# EAGLE design IV FET Array v2 (EAGLE 7.2.0)
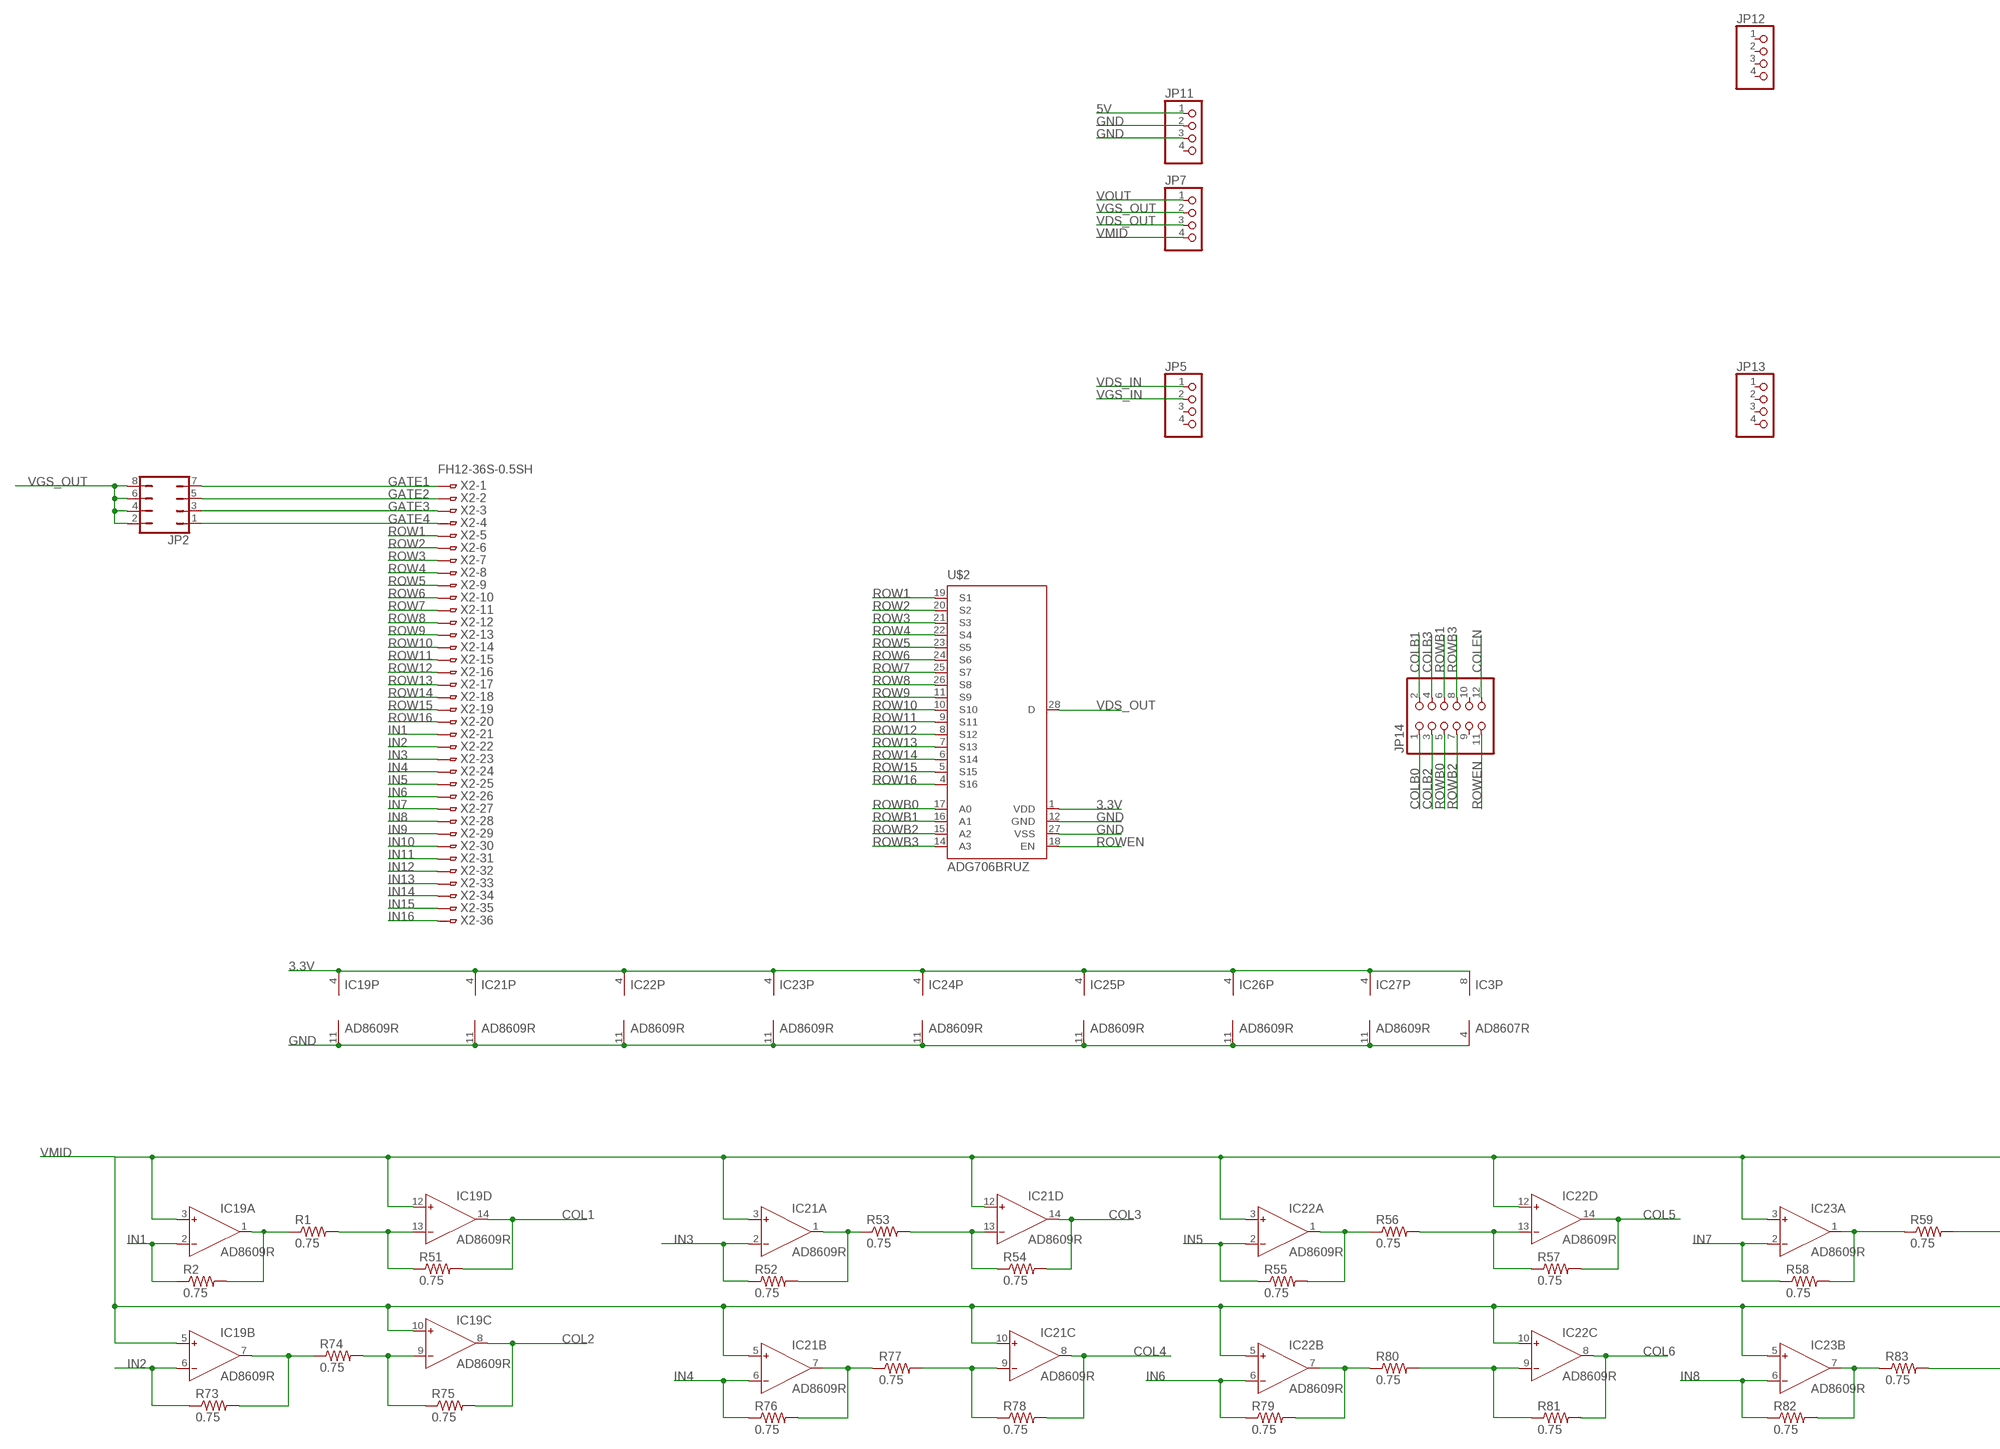
[diagram p0: schematic, sheet 1, part 1 of 2]
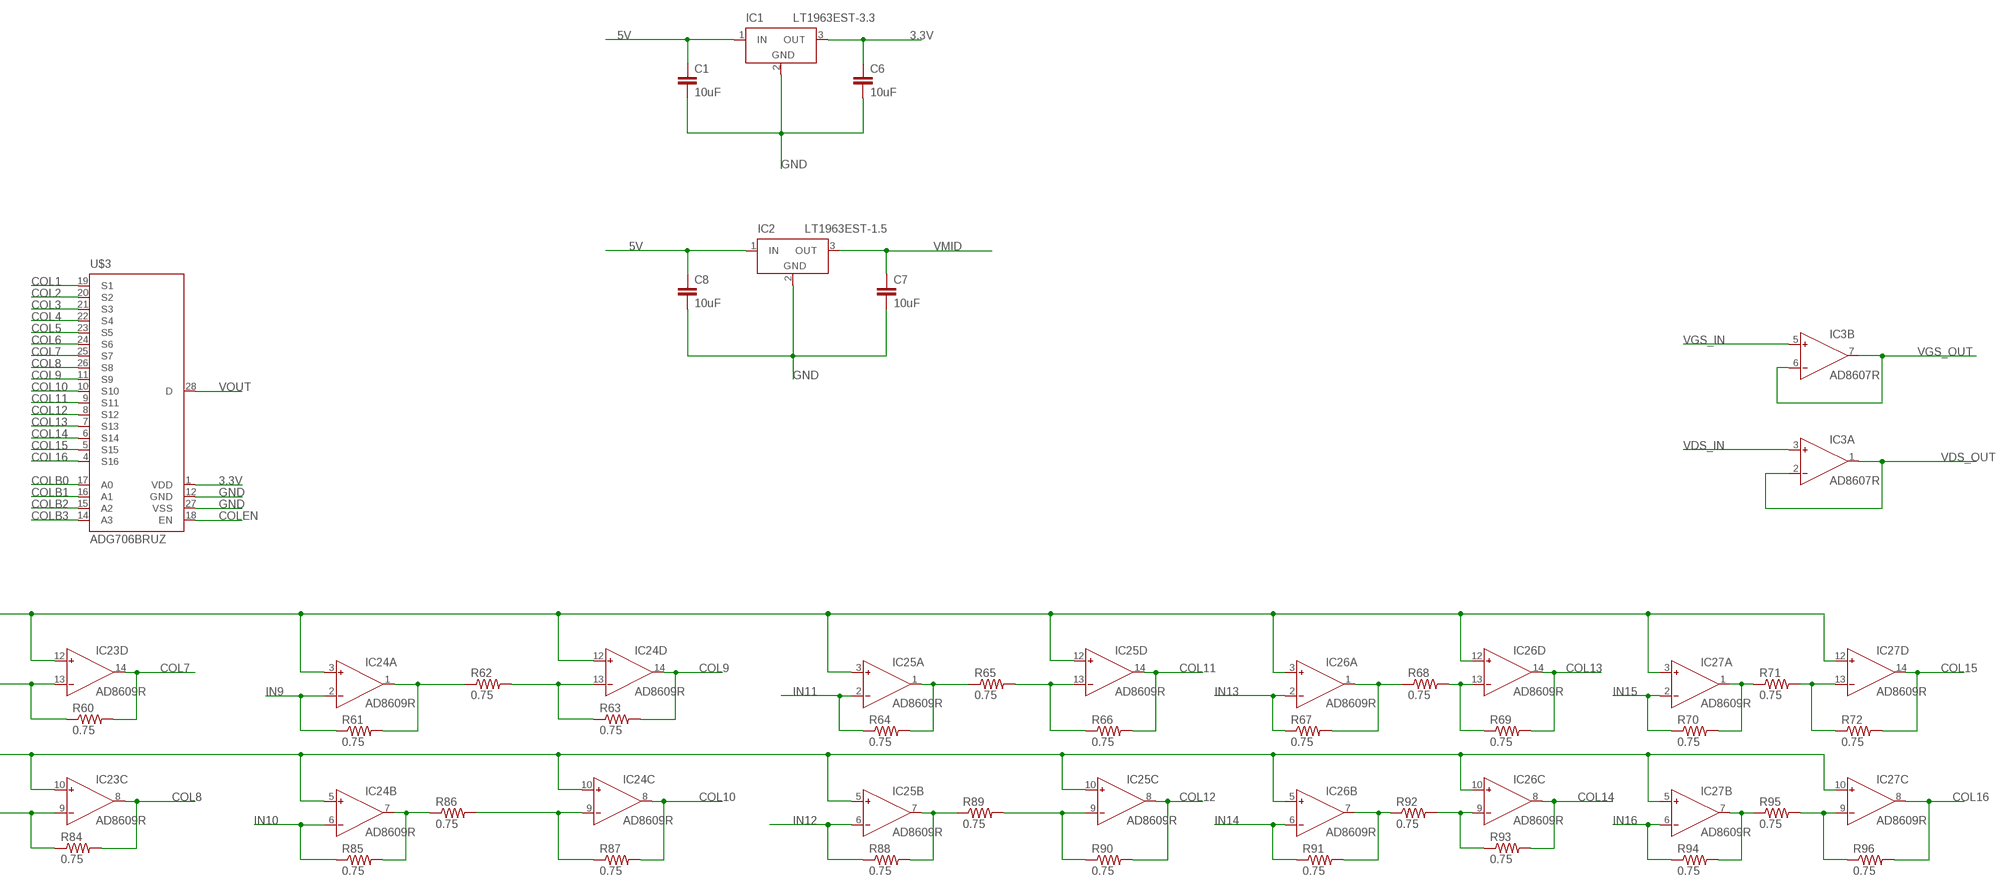
[diagram p1: schematic, sheet 1, part 2 of 2]

## Parts
C1  10uF  22UF-16V-20%-(1210)  [1210]
C6  10uF  22UF-16V-20%-(1210)  [1210]
C7  10uF  22UF-16V-20%-(1210)  [1210]
C8  10uF  22UF-16V-20%-(1210)  [1210]
IC1  LT1963EST-3.3  [SOT223]
IC2  LT1963EST-1.5  [SOT223]
IC3  AD8607R  [SO8]
IC19  AD8609R  [SO14]
IC21  AD8609R  [SO14]
IC22  AD8609R  [SO14]
IC23  AD8609R  [SO14]
IC24  AD8609R  [SO14]
IC25  AD8609R  [SO14]
IC26  AD8609R  [SO14]
IC27  AD8609R  [SO14]
JP2  JP4Q  [JP4Q]
JP5  PINHD-1X4  [1X04]
JP7  PINHD-1X4  [1X04]
JP11  PINHD-1X4  [1X04]
JP12  PINHD-1X4  [1X04]
JP13  PINHD-1X4  [1X04]
JP14  PINHD-2X6  [2X06]
R1  0.75  0.75OHM-1/4W-1%(0805)  [0805]
R2  0.75  0.75OHM-1/4W-1%(0805)  [0805]
R51  0.75  0.75OHM-1/4W-1%(0805)  [0805]
R52  0.75  0.75OHM-1/4W-1%(0805)  [0805]
R53  0.75  0.75OHM-1/4W-1%(0805)  [0805]
R54  0.75  0.75OHM-1/4W-1%(0805)  [0805]
R55  0.75  0.75OHM-1/4W-1%(0805)  [0805]
R56  0.75  0.75OHM-1/4W-1%(0805)  [0805]
R57  0.75  0.75OHM-1/4W-1%(0805)  [0805]
R58  0.75  0.75OHM-1/4W-1%(0805)  [0805]
R59  0.75  0.75OHM-1/4W-1%(0805)  [0805]
R60  0.75  0.75OHM-1/4W-1%(0805)  [0805]
R61  0.75  0.75OHM-1/4W-1%(0805)  [0805]
R62  0.75  0.75OHM-1/4W-1%(0805)  [0805]
R63  0.75  0.75OHM-1/4W-1%(0805)  [0805]
R64  0.75  0.75OHM-1/4W-1%(0805)  [0805]
R65  0.75  0.75OHM-1/4W-1%(0805)  [0805]
R66  0.75  0.75OHM-1/4W-1%(0805)  [0805]
R67  0.75  0.75OHM-1/4W-1%(0805)  [0805]
R68  0.75  0.75OHM-1/4W-1%(0805)  [0805]
R69  0.75  0.75OHM-1/4W-1%(0805)  [0805]
R70  0.75  0.75OHM-1/4W-1%(0805)  [0805]
R71  0.75  0.75OHM-1/4W-1%(0805)  [0805]
R72  0.75  0.75OHM-1/4W-1%(0805)  [0805]
R73  0.75  0.75OHM-1/4W-1%(0805)  [0805]
R74  0.75  0.75OHM-1/4W-1%(0805)  [0805]
R75  0.75  0.75OHM-1/4W-1%(0805)  [0805]
R76  0.75  0.75OHM-1/4W-1%(0805)  [0805]
R77  0.75  0.75OHM-1/4W-1%(0805)  [0805]
R78  0.75  0.75OHM-1/4W-1%(0805)  [0805]
R79  0.75  0.75OHM-1/4W-1%(0805)  [0805]
R80  0.75  0.75OHM-1/4W-1%(0805)  [0805]
R81  0.75  0.75OHM-1/4W-1%(0805)  [0805]
R82  0.75  0.75OHM-1/4W-1%(0805)  [0805]
R83  0.75  0.75OHM-1/4W-1%(0805)  [0805]
R84  0.75  0.75OHM-1/4W-1%(0805)  [0805]
R85  0.75  0.75OHM-1/4W-1%(0805)  [0805]
R86  0.75  0.75OHM-1/4W-1%(0805)  [0805]
R87  0.75  0.75OHM-1/4W-1%(0805)  [0805]
R88  0.75  0.75OHM-1/4W-1%(0805)  [0805]
R89  0.75  0.75OHM-1/4W-1%(0805)  [0805]
R90  0.75  0.75OHM-1/4W-1%(0805)  [0805]
R91  0.75  0.75OHM-1/4W-1%(0805)  [0805]
R92  0.75  0.75OHM-1/4W-1%(0805)  [0805]
R93  0.75  0.75OHM-1/4W-1%(0805)  [0805]
R94  0.75  0.75OHM-1/4W-1%(0805)  [0805]
R95  0.75  0.75OHM-1/4W-1%(0805)  [0805]
R96  0.75  0.75OHM-1/4W-1%(0805)  [0805]
U$2  ADG706BRUZ  [TSSOP28]
U$3  ADG706BRUZ  [TSSOP28]
X2  FH12-36S-0.5SH  [FH12-36S-0.5SH]

## Nets
3.3V: C6.1 IC1.3(OUT) IC3.8(P:V+) IC19.4(P:V+) IC21.4(P:V+) IC22.4(P:V+) IC23.4(P:V+) IC24.4(P:V+) IC25.4(P:V+) IC26.4(P:V+) IC27.4(P:V+) U$2.1(VDD) U$3.1(VDD)
5V: C1.1 C8.1 IC1.1(IN) IC2.1(IN) JP11.1
COL1: IC19.14(D:OUT) R51.2 U$3.19(S1)
COL2: IC19.8(C:OUT) R75.2 U$3.20(S2)
COL3: IC21.14(D:OUT) R54.2 U$3.21(S3)
COL4: IC21.8(C:OUT) R78.2 U$3.22(S4)
COL5: IC22.14(D:OUT) R57.2 U$3.23(S5)
COL6: IC22.8(C:OUT) R81.2 U$3.24(S6)
COL7: IC23.14(D:OUT) R60.2 U$3.25(S7)
COL8: IC23.8(C:OUT) R84.2 U$3.26(S8)
COL9: IC24.14(D:OUT) R63.2 U$3.11(S9)
COL10: IC24.8(C:OUT) R87.2 U$3.10(S10)
COL11: IC25.14(D:OUT) R66.2 U$3.9(S11)
COL12: IC25.8(C:OUT) R90.2 U$3.8(S12)
COL13: IC26.14(D:OUT) R69.2 U$3.7(S13)
COL14: IC26.8(C:OUT) R93.2 U$3.6(S14)
COL15: IC27.14(D:OUT) R72.2 U$3.5(S15)
COL16: IC27.8(C:OUT) R96.2 U$3.4(S16)
COLB0: JP14.1 U$3.17(A0)
COLB1: JP14.2 U$3.16(A1)
COLB2: JP14.3 U$3.15(A2)
COLB3: JP14.4 U$3.14(A3)
COLEN: JP14.12 U$3.18(EN)
GATE1: JP2.7 X2.1
GATE2: JP2.5 X2.2
GATE3: JP2.3 X2.3
GATE4: JP2.1 X2.4
GND: C1.2 C6.2 C7.2 C8.2 IC1.2(GND) IC2.2(GND) IC3.4(P:V-) IC19.11(P:V-) IC21.11(P:V-) IC22.11(P:V-) IC23.11(P:V-) IC24.11(P:V-) IC25.11(P:V-) IC26.11(P:V-) IC27.11(P:V-) JP11.2 JP11.3 U$2.12(GND) U$2.27(VSS) U$3.12(GND) U$3.27(VSS)
IN1: IC19.2(A:IN-) R2.1 X2.21
IN2: IC19.6(B:IN-) R73.1 X2.22
IN3: IC21.2(A:IN-) R52.1 X2.23
IN4: IC21.6(B:IN-) R76.1 X2.24
IN5: IC22.2(A:IN-) R55.1 X2.25
IN6: IC22.6(B:IN-) R79.1 X2.26
IN7: IC23.2(A:IN-) R58.1 X2.27
IN8: IC23.6(B:IN-) R82.1 X2.28
IN9: IC24.2(A:IN-) R61.1 X2.29
IN10: IC24.6(B:IN-) R85.1 X2.30
IN11: IC25.2(A:IN-) R64.1 X2.31
IN12: IC25.6(B:IN-) R88.1 X2.32
IN13: IC26.2(A:IN-) R67.1 X2.33
IN14: IC26.6(B:IN-) R91.1 X2.34
IN15: IC27.2(A:IN-) R70.1 X2.35
IN16: IC27.6(B:IN-) R94.1 X2.36
N$2: IC25.1(A:OUT) R64.2 R65.1
N$3: IC25.13(D:IN-) R65.2 R66.1
N$4: IC24.1(A:OUT) R61.2 R62.1
N$5: IC24.13(D:IN-) R62.2 R63.1
N$7: IC25.7(B:OUT) R88.2 R89.1
N$9: IC25.9(C:IN-) R89.2 R90.1
N$12: IC24.9(C:IN-) R86.2 R87.1
N$13: IC24.7(B:OUT) R85.2 R86.1
N$14: IC19.1(A:OUT) R1.1 R2.2
N$16: IC19.7(B:OUT) R73.2 R74.1
N$17: IC19.9(C:IN-) R74.2 R75.1
N$18: IC19.13(D:IN-) R1.2 R51.1
N$21: IC23.13(D:IN-) R59.2 R60.1
N$22: IC23.1(A:OUT) R58.2 R59.1
N$24: IC21.1(A:OUT) R52.2 R53.1
N$25: IC21.13(D:IN-) R53.2 R54.1
N$27: IC22.1(A:OUT) R55.2 R56.1
N$29: IC22.13(D:IN-) R56.2 R57.1
N$31: IC23.9(C:IN-) R83.2 R84.1
N$32: IC23.7(B:OUT) R82.2 R83.1
N$35: IC22.9(C:IN-) R80.2 R81.1
N$36: IC22.7(B:OUT) R79.2 R80.1
N$39: IC21.9(C:IN-) R77.2 R78.1
N$40: IC21.7(B:OUT) R76.2 R77.1
N$68: IC26.1(A:OUT) R67.2 R68.1
N$69: IC26.13(D:IN-) R68.2 R69.1
N$72: IC26.9(C:IN-) R92.2 R93.1
N$73: IC26.7(B:OUT) R91.2 R92.1
N$76: IC27.7(B:OUT) R94.2 R95.1
N$77: IC27.9(C:IN-) R95.2 R96.1
N$78: IC27.13(D:IN-) R71.2 R72.1
N$79: IC27.1(A:OUT) R70.2 R71.1
ROW1: U$2.19(S1) X2.5
ROW2: U$2.20(S2) X2.6
ROW3: U$2.21(S3) X2.7
ROW4: U$2.22(S4) X2.8
ROW5: U$2.23(S5) X2.9
ROW6: U$2.24(S6) X2.10
ROW7: U$2.25(S7) X2.11
ROW8: U$2.26(S8) X2.12
ROW9: U$2.11(S9) X2.13
ROW10: U$2.10(S10) X2.14
ROW11: U$2.9(S11) X2.15
ROW12: U$2.8(S12) X2.16
ROW13: U$2.7(S13) X2.17
ROW14: U$2.6(S14) X2.18
ROW15: U$2.5(S15) X2.19
ROW16: U$2.4(S16) X2.20
ROWB0: JP14.5 U$2.17(A0)
ROWB1: JP14.6 U$2.16(A1)
ROWB2: JP14.7 U$2.15(A2)
ROWB3: JP14.8 U$2.14(A3)
ROWEN: JP14.11 U$2.18(EN)
VDS_IN: IC3.3(A:IN+) JP5.1
VDS_OUT: IC3.1(A:OUT) IC3.2(A:IN-) JP7.3 U$2.28(D)
VGS_IN: IC3.5(B:IN+) JP5.2
VGS_OUT: IC3.6(B:IN-) IC3.7(B:OUT) JP2.2 JP2.4 JP2.6 JP2.8 JP7.2
VMID: C7.1 IC2.3(OUT) IC19.3(A:IN+) IC19.5(B:IN+) IC19.10(C:IN+) IC19.12(D:IN+) IC21.3(A:IN+) IC21.5(B:IN+) IC21.10(C:IN+) IC21.12(D:IN+) IC22.3(A:IN+) IC22.5(B:IN+) IC22.10(C:IN+) IC22.12(D:IN+) IC23.3(A:IN+) IC23.5(B:IN+) IC23.10(C:IN+) IC23.12(D:IN+) IC24.3(A:IN+) IC24.5(B:IN+) IC24.10(C:IN+) IC24.12(D:IN+) IC25.3(A:IN+) IC25.5(B:IN+) IC25.10(C:IN+) IC25.12(D:IN+) IC26.3(A:IN+) IC26.5(B:IN+) IC26.10(C:IN+) IC26.12(D:IN+) IC27.3(A:IN+) IC27.5(B:IN+) IC27.10(C:IN+) IC27.12(D:IN+) JP7.4
VOUT: JP7.1 U$3.28(D)
Unconnected: JP5.3 JP5.4 JP11.4 JP12.1 JP12.2 JP12.3 JP12.4 JP13.1 JP13.2 JP13.3 JP13.4 JP14.9 JP14.10

## Power pins joined to a net without a drawn wire
GND: IC1.4(GND) IC2.4(GND)

## Library data of the parts
C1 C6-C8 = SparkFun-Capacitors:22UF-16V-20%-(1210): CAP-10381; PROD_ID: CAP-10381; VALUE: 22uF
IC1 = linear-technology:LT1963EST: 1.5A, Low Noise, Fast Transient Response LDO Regulator Source: http://www.linear.com/pc/downloadDocument.do?navId=H0,C3,P2222,D3148; MPN: LT1963EST-3.3; OC_FARNELL: 1501032; OC_NEWARK: 57M7546
IC2 = linear-technology:LT1963EST: 1.5A, Low Noise, Fast Transient Response LDO Regulator Source: http://www.linear.com/pc/downloadDocument.do?navId=H0,C3,P2222,D3148; MPN: LT1963EST-1.5; OC_FARNELL: 1663528; OC_NEWARK: 57M7534
IC3 = analog-devices:AD8607: Precision Micropower, Low Noise CMOS, Rail-to-Rail Input/Output Operational Amplifiers Source: http://www.analog.com/static/imported-files/data_sheets/AD8603_8607_8609.pdf; MPN: AD8607ARMZ-R2; OC_FARNELL: 1651293; OC_NEWARK: 19M8927
IC19 IC21-IC27 = analog-devices:AD8609: Precision Micropower, Low Noise CMOS, Rail-to-Rail Input/Output Operational Amplifiers Source: http://www.analog.com/static/imported-files/data_sheets/AD8603_8607_8609.pdf; MPN: AD8609ARZ; OC_FARNELL: 1581951; OC_NEWARK: 19M0976
JP2 = jumper:JP4Q: JUMPER
JP5 JP7 JP11-JP13 = pinhead:PINHD-1X4: PIN HEADER
JP14 = pinhead:PINHD-2X6: PIN HEADER
R1 R2 R51-R96 = SparkFun-Resistors:0.75OHM-1/4W-1%(0805): RES-08474; PROD_ID: RES-08474
U$2 U$3 = mux:ADG706: CMOS, +1.8 V to +5.5 V/±2.5 V, 2.5 Ω Low-Voltage, 16-Channel Multiplexer Source: ADG706.pdf; RS: 523-6478
X2 = con-hirose:FH12-36S-0.5S: 0.5mm Pitch Connectors For FPC/FFC Source: Data sheet <http://www.hirose.co.jp/cataloge_hp/e58605370.pdf>; OC_FARNELL: unknown; OC_NEWARK: unknown

## Board
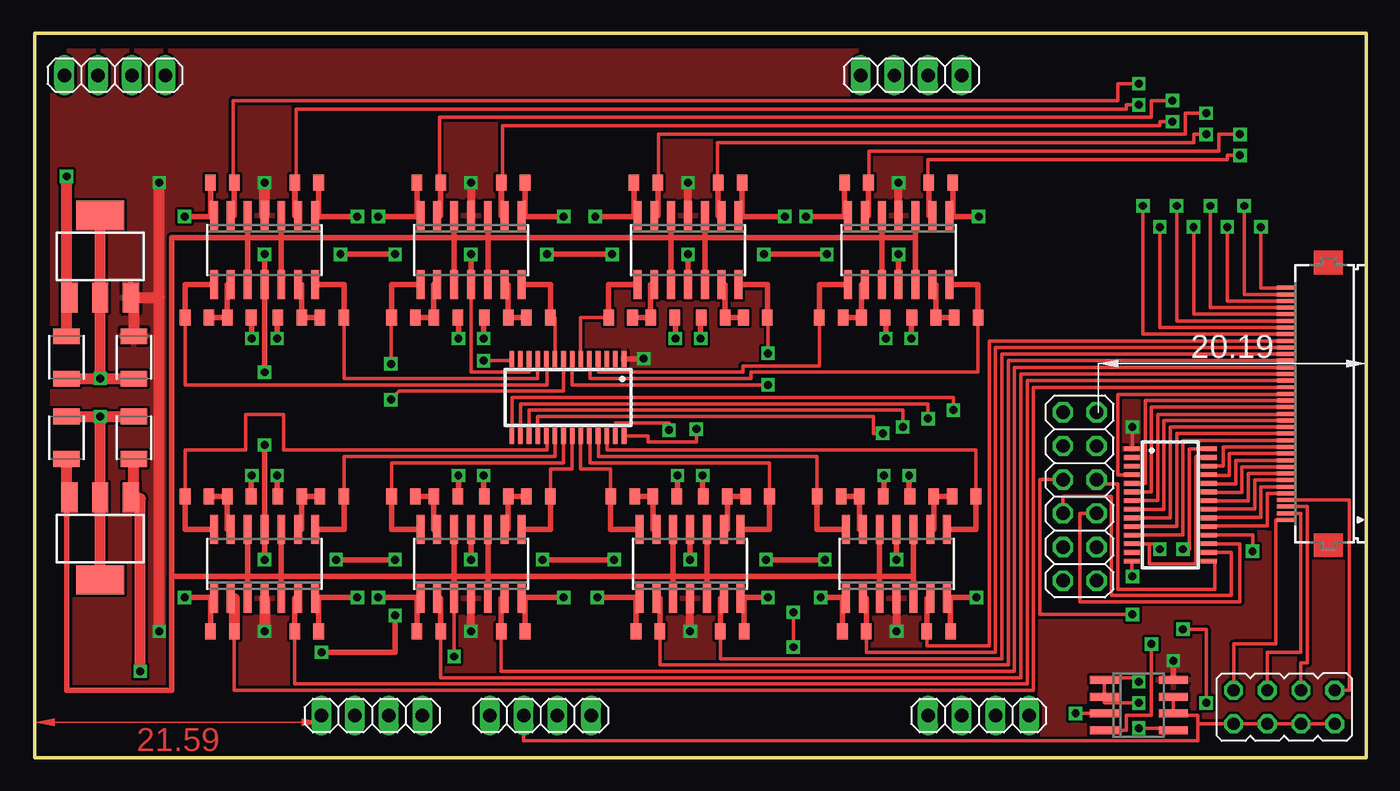
[diagram p2: board, top side]
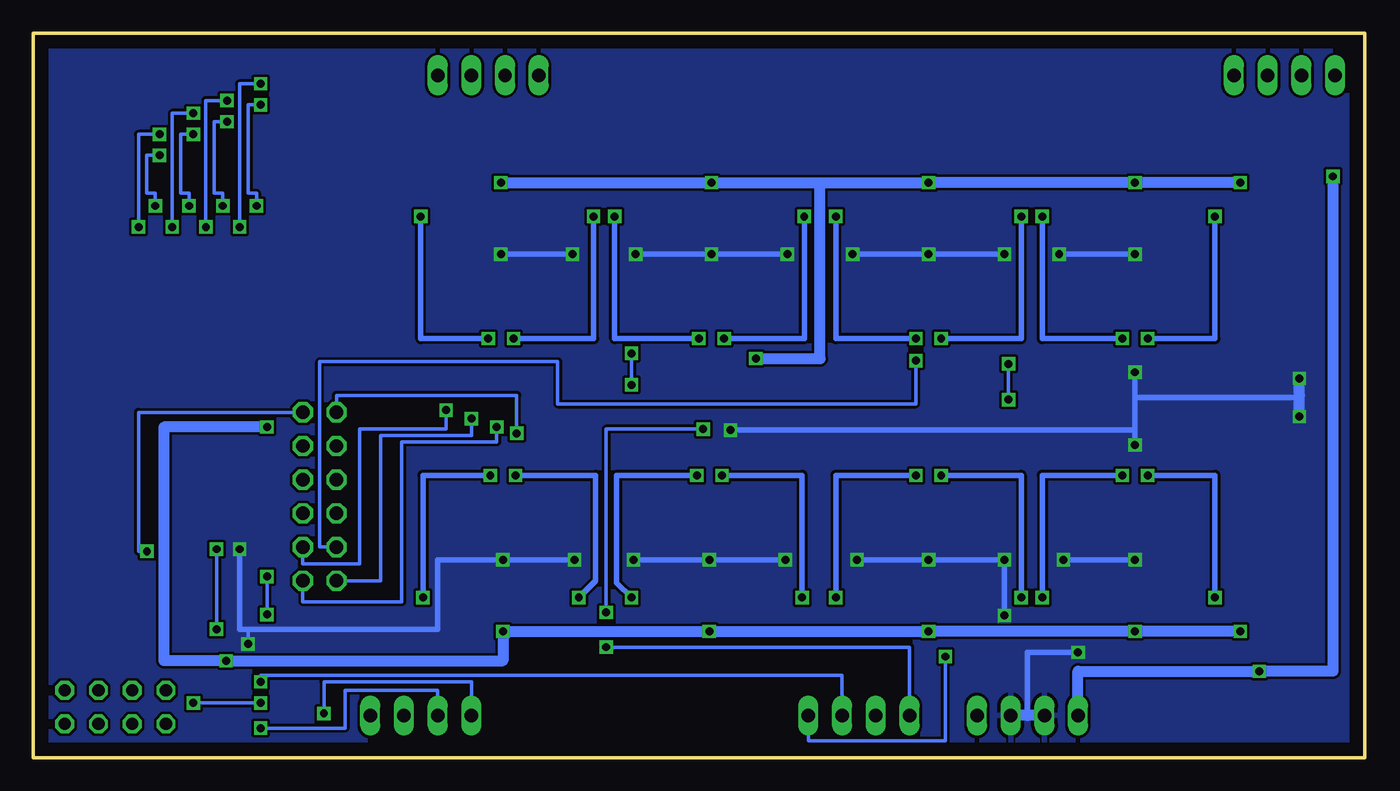
[diagram p3: board, bottom side, seen from below]

Size 100.33 x 54.61 mm. Coordinates in mm from the lower left corner, seen from the top.
Outline: 100.33,0 0,0 0,54.61 100.33,54.61 100.33,0
Copper layers (1*16): Top 0.035mm / dielectric 1.5mm / Bottom 0.035mm
Design rules "default": minimum track width 10mil, minimum drill 24mil, track to track 8mil, track to pad 8mil, pad to pad 8mil, via to via 8mil, smd to smd 8mil, copper to edge 40mil, drill to drill 8mil, minimum pad ring 10mil, minimum via ring 8mil, stop-mask expansion 4mil, vias tented up to drill 0mil, thermal gap 10mil

### Footprints (pad centres in the part's own frame; a part is rotated, then mirrored left to right if it is on the bottom)
1210 = smd 1.2 x 2: 1 -1.6,0; 2 1.6,0
SOT223 = smd 1.219 x 2.235: 1 -2.311,-3.099; 2 0,-3.099; 3 2.311,-3.099 | smd 3.6 x 2.2: 4 0,3.099
SO8 = smd 0.6 x 2.2: 1 -1.905,-2.6; 2 -0.635,-2.6; 3 0.635,-2.6; 4 1.905,-2.6; 5 1.905,2.6; 6 0.635,2.6; 7 -0.635,2.6; 8 -1.905,2.6
SO14 = smd 0.6 x 2.2: 1 -3.81,-2.6; 2 -2.54,-2.6; 3 -1.27,-2.6; 4 0,-2.6; 5 1.27,-2.6; 6 2.54,-2.6; 7 3.81,-2.6; 8 3.81,2.6; 9 2.54,2.6; 10 1.27,2.6; 11 0,2.6; 12 -1.27,2.6; 13 -2.54,2.6; 14 -3.81,2.6
JP4Q = drill 0.914 octagon: 1 -3.81,-1.27; 2 -3.81,1.27; 3 -1.27,-1.27; 4 -1.27,1.27; 5 1.27,-1.27; 6 1.27,1.27; 7 3.81,-1.27; 8 3.81,1.27
1X04 = drill 1.016 long: 1 -3.81,0; 2 -1.27,0; 3 1.27,0; 4 3.81,0
2X06 = drill 1.016 octagon: 1 -6.35,-1.27; 2 -6.35,1.27; 3 -3.81,-1.27; 4 -3.81,1.27; 5 -1.27,-1.27; 6 -1.27,1.27; 7 1.27,-1.27; 8 1.27,1.27; 9 3.81,-1.27; 10 3.81,1.27; 11 6.35,-1.27; 12 6.35,1.27
0805 = smd 0.8 x 1.2: 1 -0.9,0; 2 0.9,0
TSSOP28 = smd 0.35 x 1.2: 1 -4.225,-2.9; 2 -3.575,-2.9; 3 -2.925,-2.9; 4 -2.275,-2.9; 5 -1.625,-2.9; 6 -0.975,-2.9; 7 -0.325,-2.9; 8 0.325,-2.9; 9 0.975,-2.9; 10 1.625,-2.9; 11 2.275,-2.9; 12 2.925,-2.9; 13 3.575,-2.9; 14 4.225,-2.9; 15 4.225,2.9; 16 3.575,2.9; 17 2.925,2.9; 18 2.275,2.9; 19 1.625,2.9; 20 0.975,2.9; 21 0.325,2.9; 22 -0.325,2.9; 23 -0.975,2.9; 24 -1.625,2.9; 25 -2.275,2.9; 26 -2.925,2.9; 27 -3.575,2.9; 28 -4.225,2.9
FH12-36S-0.5SH = smd 0.3 x 1.3: 1 -8.75,3.25; 2 -8.25,3.25; 3 -7.75,3.25; 4 -7.25,3.25; 5 -6.75,3.25; 6 -6.25,3.25; 7 -5.75,3.25; 8 -5.25,3.25; 9 -4.75,3.25; 10 -4.25,3.25; 11 -3.75,3.25; 12 -3.25,3.25; 13 -2.75,3.25; 14 -2.25,3.25; 15 -1.75,3.25; 16 -1.25,3.25; 17 -0.75,3.25; 18 -0.25,3.25; 19 0.25,3.25; 20 0.75,3.25; 21 1.25,3.25; 22 1.75,3.25; 23 2.25,3.25; 24 2.75,3.25; 25 3.25,3.25; 26 3.75,3.25; 27 4.25,3.25; 28 4.75,3.25; 29 5.25,3.25; 30 5.75,3.25; 31 6.25,3.25; 32 6.75,3.25; 33 7.25,3.25; 34 7.75,3.25; 35 8.25,3.25; 36 8.75,3.25

### Placement (x,y rotation side)
C1  2.38,30.16 270 top
C6  7.46,30.16 270 top
C7  2.38,24.13 90 top
C8  7.46,24.13 90 top
IC1  4.92,37.78 0 top
IC2  4.92,16.51 180 top
IC3  83.19,3.97 270 top
IC19  17.3,14.61 0 top
IC21  32.86,14.61 0 top
IC22  49.37,14.61 0 top
IC23  64.93,14.61 0 top
IC24  17.3,38.26 180 top
IC25  32.86,38.26 180 top
IC26  49.21,38.26 180 top
IC27  65.09,38.26 180 top
JP2  94.14,3.81 180 top
JP5  71.12,3.17 0 top
JP7  38.1,3.17 0 top
JP11  25.4,3.17 0 top
JP12  6.03,51.44 0 top
JP13  66.04,51.44 0 top
JP14  78.74,19.68 90 top
R1  15.4,19.68 180 top
R2  14.13,9.53 180 top
R51  12.22,19.68 180 top
R52  29.69,9.53 180 top
R53  30.96,19.68 180 top
R54  27.78,19.68 180 top
R55  46.2,9.53 180 top
R56  47.47,19.68 180 top
R57  44.29,19.68 180 top
R58  61.75,9.53 180 top
R59  63.02,19.68 180 top
R60  59.85,19.68 180 top
R61  20.48,43.34 0 top
R62  19.21,33.18 0 top
R63  22.38,33.18 0 top
R64  36.04,43.34 0 top
R65  34.77,33.18 0 top
R66  37.94,33.18 0 top
R67  52.39,43.34 0 top
R68  51.12,33.18 0 top
R69  54.29,33.18 0 top
R70  68.26,43.34 0 top
R71  66.99,33.18 0 top
R72  70.17,33.18 0 top
R73  20.48,9.53 0 top
R74  19.21,19.68 0 top
R75  22.38,19.68 0 top
R76  36.04,9.53 0 top
R77  34.77,19.68 0 top
R78  37.94,19.68 0 top
R79  52.55,9.53 0 top
R80  51.28,19.68 0 top
R81  54.45,19.68 0 top
R82  68.1,9.53 0 top
R83  66.83,19.68 0 top
R84  70.01,19.68 0 top
R85  14.13,43.34 180 top
R86  15.4,33.18 180 top
R87  12.22,33.18 180 top
R88  29.69,43.34 180 top
R89  30.96,33.18 180 top
R90  27.78,33.18 180 top
R91  46.04,43.34 180 top
R92  47.31,33.18 180 top
R93  44.13,33.18 180 top
R94  61.91,43.34 180 top
R95  63.18,33.18 180 top
R96  60.01,33.18 180 top
U$2  85.57,19.05 270 top
U$3  40.16,27.15 180 top
X2  97.47,26.67 90 top

### Tracks (layer width: path | path; a pad name or v marks a point on that pad's centre or on a via)
3.3V  (via drill 0.6)
  Top 0.254: U$2.1 82.71,23.27 v82.71,24.92
  Top 0.406: v85.78,7.3 IC3.8 | U$3.1 45.88,30.05 v45.88,30.08
  Top 0.61: IC23.4 v64.93,9.53 | v49.37,9.53 IC22.4 | v32.86,9.53 IC21.4 | IC26.4 v49.21,43.34 | v32.86,43.34 IC25.4 | IC27.4 v65.09,43.34
  Top 0.813: IC1.3 7.46,34.68 | 7.46,34.68 C6.1 | IC19.4 v17.3,9.53 | IC24.4 v17.3,43.34 | 7.46,34.68 9.37,34.68 | 9.37,34.68 v9.37,43.34 | v9.37,9.53 9.37,34.68
  Bottom 0.813: 41.04,43.34 v49.21,43.34 v65.09,43.34 | 41.04,43.34 v32.86,43.34 v17.3,43.34 v9.37,43.34 | v82.71,24.92 90.49,24.92 90.49,7.3 v85.78,7.3 64.93,7.3 v64.93,9.53 v49.37,9.53 v32.86,9.53 v17.3,9.53 v9.37,9.53 | 41.04,43.34 41.04,30.08 v45.88,30.08
  pour Top: 0,0 100.33,0 100.33,54.61 0,54.61
5V  (via drill 0.6)
  Top 0.813: C8.1 7.46,19.61 IC2.1 7.23,19.53 7.94,19.53 v7.94,6.51 | IC1.1 2.38,34.68 | C1.1 2.38,34.68 | 2.38,34.68 v2.38,43.81
  Bottom 0.813: JP11.1 21.59,6.51 v7.94,6.51 2.38,6.51 v2.38,43.81
COL1
  Top 0.254: U$3.19 38.58,24.09 38.58,23.18 18.73,23.18 18.73,25.88 15.88,25.88 15.88,23.18 11.32,23.18 R51.2
  Top 0.406: IC19.14 11.32,17.2 R51.2
COL2
  Top 0.254: U$3.20 39.21,24.09 39.21,22.7 23.28,22.7 R75.2
  Top 0.406: IC19.8 23.28,17.2 R75.2
COL3
  Top 0.254: U$3.21 39.85,24.09 39.85,22.23 26.88,22.23 R54.2
  Top 0.406: IC21.14 26.88,17.2 R54.2
COL4
  Top 0.254: U$3.22 40.48,24.09 40.48,21.75 38.84,21.75 R78.2
  Top 0.406: IC21.8 38.84,17.2 R78.2
COL5
  Top 0.254: U$3.23 41.12,24.09 41.12,21.75 43.39,21.75 R57.2
  Top 0.406: IC22.14 43.39,17.2 R57.2
COL6
  Top 0.254: U$3.24 41.83,24.09 41.83,22.23 55.35,22.23 R81.2
  Top 0.406: IC22.8 55.35,17.2 R81.2
COL7
  Top 0.254: U$3.25 42.47,24.09 42.47,22.7 58.95,22.7 R60.2
  Top 0.406: IC23.14 58.95,17.2 R60.2
COL8
  Top 0.254: U$3.26 43.1,24.09 43.1,23.18 70.91,23.18 R84.2
  Top 0.406: IC23.8 70.91,17.2 R84.2
COL9
  Top 0.254: U$3.11 37.86,29.89 37.86,28.57 23.28,28.57 R63.2
  Top 0.406: IC24.14 23.28,35.66 R63.2
COL10
  Top 0.254: U$3.10 38.58,29.89 38.58,28.1 11.32,28.1 R87.2
  Top 0.406: IC24.8 11.32,35.66 R87.2
COL11
  Top 0.254: R66.2 38.89,33.18 | 38.89,33.18 38.89,35.72 | 38.89,33.18 39.19,33.18 U$3.9
  Top 0.406: IC25.14 38.84,35.66 R66.2
COL12  (via drill 0.6)
  Top 0.254: U$3.8 39.85,29.89 39.85,27.62 27.46,27.62 v26.83,26.99 | R90.2 26.83,33.18 v26.83,29.69
  Top 0.406: IC25.8 26.88,35.66 R90.2
  Bottom 0.254: v26.83,26.99 v26.83,29.69
COL13  (via drill 0.6)
  Top 0.254: R69.2 55.24,33.18 v55.24,30.48 | U$3.7 40.48,29.89 40.48,28.1 v55.24,28.1
  Top 0.406: IC26.14 55.19,35.66 R69.2
  Bottom 0.254: v55.24,30.48 v55.24,28.1
COL14
  Top 0.254: U$3.6 41.12,29.89 41.12,33.18 R93.2
  Top 0.406: IC26.8 43.23,35.66 R93.2
COL15
  Top 0.254: U$3.5 41.83,29.89 41.83,28.57 53.98,28.57 53.98,29.05 71.07,29.05 R72.2
  Top 0.406: IC27.14 71.07,35.66 R72.2
COL16
  Top 0.254: U$3.4 42.47,29.89 42.47,29.05 53.34,29.05 53.34,29.53 59.11,29.53 R96.2
  Top 0.406: IC27.8 59.11,35.66 R96.2
COLB0  (via drill 0.6)
  Top 0.254: U$3.17 37.23,24.09 37.23,26.19 65.41,26.19 v65.41,24.92
  Bottom 0.254: v65.41,24.92 65.41,23.81 72.55,23.81 72.55,11.75 80.01,11.75 JP14.1
COLB1  (via drill 0.6)
  Top 0.254: U$3.16 36.59,24.09 36.59,26.67 67.31,26.67 v67.31,25.56
  Bottom 0.254: v67.31,25.56 67.31,24.29 74.14,24.29 74.14,13.34 JP14.2
COLB2  (via drill 0.6)
  Top 0.254: U$3.15 35.96,24.25 35.96,27.15 69.22,27.15 v69.22,26.19
  Bottom 0.254: v69.22,26.19 69.22,24.77 75.72,24.77 75.72,14.61 80.01,14.61 JP14.3
COLB3  (via drill 0.6)
  Top 0.254: v33.81,29.92 35.94,29.92 U$3.14
  Bottom 0.254: JP14.4 78.74,15.88 78.74,29.84 60.8,29.84 60.8,26.67 33.81,26.67 v33.81,29.92
COLEN  (via drill 0.6)
  Top 0.254: U$3.18 37.86,24.09 37.86,25.72 63.18,25.72 63.18,24.45 v63.9,24.45
  Bottom 0.254: v63.9,24.45 63.9,27.3 77.47,27.3 JP14.12
GATE1
  Top 0.254: X2.1 93.5,17.92 93.5,8.57 90.33,8.57 JP2.7
GATE2
  Top 0.254: X2.2 95.41,18.42 95.41,7.94 92.87,7.94 JP2.5
GATE3
  Top 0.254: X2.3 95.89,18.92 95.89,7.14 95.41,7.14 JP2.3
GATE4
  Top 0.254: X2.4 99.03,19.42 99.03,5.08 JP2.1
GND  (via drill 0.6)
  Top 0.254: U$2.27 88.94,22.62 87.47,22.7 87.47,14.61 83.98,14.61 83.98,16.12 U$2.12 84.93,16.12 v84.77,15.72 | IC25.11 32.86,29.05 37.24,29.05 U$3.12 | U$3.27 43.74,25.24 47.78,25.24 v47.78,24.69 | IC3.4 82.23,2.06 82.23,3.17 84.14,3.17 v84.14,8.57
  Top 0.406: IC23.11 v64.93,14.92 | v59.53,14.92 v55.09,14.92 | v49.37,14.92 IC22.11 | IC21.11 v32.86,14.92 | v38.26,14.92 v43.66,14.92 | v17.3,14.92 IC19.11 v17.3,23.57 | v22.7,14.92 v27.15,14.92 | IC27.11 v65.09,37.94 | v59.69,37.94 v54.93,37.94 | v49.21,37.94 IC26.11 | IC25.11 v32.86,37.94 | v38.58,37.94 v43.5,37.94 | v17.3,37.94 IC24.11 v17.3,29.05 | v23.02,37.94 v27.15,37.94 | v27.15,10.72 27.15,7.94 v21.59,7.94
  Top 0.813: v4.92,25.72 IC2.2 IC2.4 | 2.38,25.72 C7.2 v4.92,25.73 v4.92,25.72 | 2.38,28.57 C1.2 v4.92,28.56 v4.92,28.57 | IC1.4 IC1.2 v4.92,28.57 | v4.92,28.57 7.46,28.57 C6.2 | v4.92,25.72 7.46,25.72 C8.2
  Bottom 0.254: v84.14,8.57 84.14,9.68
  Bottom 0.406: v59.53,14.92 v64.93,14.92 69.85,14.92 69.85,9.68 84.14,9.68 84.77,9.68 v84.77,15.72 | v55.09,14.92 v49.37,14.92 v43.66,14.92 | v38.26,14.92 v32.86,14.92 v27.15,14.92 v27.15,10.72 | v17.3,14.92 v22.7,14.92 | v65.09,37.94 v59.69,37.94 | v54.93,37.94 v49.21,37.94 v43.5,37.94 | v38.58,37.94 v32.86,37.94 v27.15,37.94 | v17.3,37.94 v23.02,37.94 | v17.3,29.05 17.3,27.15 | 17.3,27.15 4.92,27.15 4.92,27.3 | v47.78,24.69 17.3,24.69 | 17.3,24.69 17.3,27.15 | v17.3,23.57 17.3,24.69 | 25.4,3.17 25.4,7.94 v21.59,7.94
  Bottom 0.813: v4.92,25.72 4.92,27.3 v4.92,28.57 | JP11.2 25.4,3.17 JP11.3
  pour Bottom: 0,0 100.33,0 100.33,54.61 0,54.61
IN1
  Top 0.254: X2.21 75.25,27.92 75.25,5.08 15.03,5.08 R2.1
  Top 0.406: IC19.2 15.03,12.01
  Top 0.813: 15.03,12.01 R2.1
IN2
  Top 0.254: X2.22 74.77,28.42 74.77,5.56 19.58,5.56 R73.1
  Top 0.406: IC19.6 19.58,12.01 R73.1
IN3
  Top 0.254: X2.23 74.3,28.92 74.3,6.03 30.59,6.03 R52.1
  Top 0.406: IC21.2 30.59,12.01 R52.1
IN4
  Top 0.254: X2.24 73.82,29.42 73.82,6.51 35.14,6.51 R76.1
  Top 0.406: IC21.6 35.14,12.01 R76.1
IN5
  Top 0.254: X2.25 73.34,29.92 73.34,6.99 47.1,6.99 R55.1
  Top 0.406: IC22.2 47.1,12.01 R55.1
IN6
  Top 0.254: X2.26 72.87,30.42 72.87,7.46 51.65,7.46 R79.1
  Top 0.406: IC22.6 51.65,12.01 R79.1
IN7
  Top 0.254: X2.27 72.39,30.92 72.39,7.94 62.65,7.94 R58.1
  Top 0.406: IC23.2 62.65,12.01 R58.1
IN8
  Top 0.254: X2.28 71.91,31.42 71.91,8.41 67.2,8.41 R82.1
  Top 0.406: IC23.6 67.2,12.01 R82.1
IN9  (via drill 0.6)
  Top 0.254: 19.68,40.86 19.68,48.9 82.23,48.9 82.23,49.21 v83.19,49.21 | 94.22,31.91 X2.29 83.5,31.92 v83.5,41.59
  Top 0.406: IC24.2 19.68,40.86 19.58,40.86 R61.1
  Bottom 0.254: v83.19,49.21 84.14,49.21 84.14,42.55 83.5,42.55 v83.5,41.59
IN10  (via drill 0.6)
  Top 0.254: IC24.6 14.92,40.86 14.92,49.53 81.6,49.53 81.6,50.8 v83.19,50.8 | 94.22,32.38 X2.30 84.77,32.42 v84.77,40.01
  Top 0.406: IC24.6 15.03,40.86 R85.1
  Bottom 0.254: v83.19,50.8 84.77,50.8 v84.77,40.01
IN11  (via drill 0.6)
  Top 0.254: IC25.2 35.24,40.86 35.24,47.62 84.77,47.62 84.77,47.94 v85.72,47.94 | v86.04,41.59 86.04,33.34 86.04,33.02 86.04,32.92 X2.31
  Top 0.406: IC25.2 35.14,40.86 R64.1
  Bottom 0.254: v85.72,47.94 86.68,47.94 86.68,42.55 86.04,42.55 v86.04,41.59
IN12  (via drill 0.6)
  Top 0.254: X2.32 87.31,33.42 v87.31,40.01 | 30.48,40.86 30.48,48.26 84.14,48.26 84.14,49.53 v85.72,49.53
  Top 0.406: IC25.6 30.48,40.86 30.59,40.86 R88.1
  Bottom 0.254: v85.72,49.53 87.31,49.53 v87.31,40.01
IN13  (via drill 0.6)
  Top 0.254: IC26.2 51.44,40.86 51.44,46.35 87.31,46.35 87.31,46.99 v88.27,46.99 | 94.22,33.89 X2.33 88.58,33.92 v88.58,41.59
  Top 0.406: IC26.2 51.49,40.86 R67.1
  Bottom 0.254: v88.27,46.99 89.22,46.99 89.22,42.55 88.58,42.55 v88.58,41.59
IN14  (via drill 0.6)
  Top 0.254: 46.94,40.86 46.99,40.86 46.99,46.99 86.68,46.99 86.68,48.58 v88.27,48.58 | v89.85,40.01 89.85,34.42 X2.34
  Top 0.406: IC26.6 46.94,40.86 R91.1
  Bottom 0.254: v88.27,48.58 89.85,48.58 v89.85,40.01
IN15  (via drill 0.6)
  Top 0.254: IC27.2 67.31,40.86 67.31,45.09 89.85,45.09 89.85,45.4 v90.81,45.4 | X2.35 91.12,34.92 v91.12,41.59
  Top 0.406: IC27.2 67.36,40.86 R70.1
  Bottom 0.254: v90.81,45.4 91.76,45.4 91.76,42.55 91.12,42.55 v91.12,41.59
IN16  (via drill 0.6)
  Top 0.254: 62.81,40.86 62.87,40.86 62.87,45.72 89.22,45.72 89.22,46.99 v90.81,46.99 | v92.39,40.01 92.39,35.4 94.22,35.4 X2.36
  Top 0.406: IC27.6 62.81,40.86 R94.1
  Bottom 0.254: v90.81,46.99 92.39,46.99 v92.39,40.01
N$2  (via drill 0.6)
  Top 0.406: R64.2 36.94,40.86 IC25.1 36.67,40.8 v39.85,40.8 | R65.1 33.81,33.18 v33.81,31.59
  Bottom 0.406: v33.81,31.59 39.85,31.59 v39.85,40.8
N$3
  Top 0.406: R66.1 R65.2 35.67,35.66 IC25.13
N$4  (via drill 0.6)
  Top 0.406: R61.2 21.38,40.86 IC24.1 21.11,40.8 v24.29,40.8 | R62.1 18.26,33.18 v18.26,31.59
  Bottom 0.406: v18.26,31.59 24.29,31.59 v24.29,40.8
N$5
  Top 0.406: IC24.13 20.11,35.66 R62.2 R63.1
N$7  (via drill 0.6)
  Top 0.406: R88.2 28.79,40.86 IC25.7 29.05,40.8 v25.88,40.8 | R89.1 31.91,33.18 v31.91,31.59
  Bottom 0.406: v31.91,31.59 25.88,31.59 v25.88,40.8
N$9
  Top 0.406: IC25.9 30.06,35.66 R89.2 R90.1
N$12
  Top 0.406: IC24.9 14.5,35.66 R86.2 R87.1
N$13  (via drill 0.6)
  Top 0.406: R85.2 13.23,40.86 IC24.7 13.49,40.8 v11.27,40.8 | R86.1 16.35,33.18 v16.35,31.59
  Bottom 0.406: v16.35,31.59 11.27,31.59 v11.27,40.8
N$14  (via drill 0.6)
  Top 0.406: v11.27,12.06 13.49,12.06 IC19.1 13.23,12.01 R2.2 | v16.35,21.27 16.3,21.27 R1.1
  Bottom 0.406: v16.35,21.27 11.27,21.27 v11.27,12.06
N$16  (via drill 0.6)
  Top 0.406: R73.2 21.38,12.01 IC19.7 21.11,12.06 v24.29,12.06 | R74.1 18.26,19.68 v18.26,21.27
  Bottom 0.406: v18.26,21.27 24.29,21.27 v24.29,12.06
N$17
  Top 0.406: R75.1 R74.2 20.11,17.2 IC19.9
N$18
  Top 0.406: R51.1 R1.2 14.5,17.2 IC19.13
N$21
  Top 0.406: R60.1 R59.2 62.12,17.2 IC23.13
N$22  (via drill 0.6)
  Top 0.406: IC23.1 60.85,12.01 R58.2 | R59.1 63.98,19.68 v63.98,21.27 | 61.12,12.06 IC23.1 | v59.21,12.06 61.06,12.06 IC23.1
  Bottom 0.406: v63.98,21.27 57.94,21.27 57.94,13.34 v59.21,12.06
N$24  (via drill 0.6)
  Top 0.406: R52.2 28.79,12.01 IC21.1 29.05,12.06 v25.88,12.06 | R53.1 31.91,19.68 v31.91,21.27
  Bottom 0.406: v31.91,21.27 25.88,21.27 v25.88,12.06
N$25
  Top 0.406: IC21.13 30.06,17.2 R53.2 R54.1
N$27  (via drill 0.6)
  Top 0.406: R55.2 45.3,12.01 IC22.1 45.56,12.06 v42.39,12.06 | R56.1 48.42,19.68 v48.42,21.27
  Bottom 0.406: v48.42,21.27 42.39,21.27 v42.39,12.06
N$29
  Top 0.406: IC22.13 46.57,17.2 R56.2 R57.1
N$31
  Top 0.406: IC23.9 67.73,17.2 R83.2 R84.1
N$32  (via drill 0.6)
  Top 0.406: R82.2 69,12.01 IC23.7 68.74,12.06 v70.96,12.06 | R83.1 65.88,19.68 v65.88,21.27
  Bottom 0.406: v65.88,21.27 70.96,21.27 v70.96,12.06
N$35
  Top 0.406: IC22.9 52.18,17.2 R80.2 R81.1
N$36  (via drill 0.6)
  Top 0.406: IC22.7 53.45,12.01 R79.2 | R80.1 50.32,19.68 v50.32,21.27 | 53.18,12.06 IC22.7 | v55.24,12.06 53.24,12.06 IC22.7
  Bottom 0.406: v50.32,21.27 56.36,21.27 56.36,13.18 v55.24,12.06
N$39
  Top 0.406: IC21.9 35.67,17.2 R77.2 R78.1
N$40  (via drill 0.6)
  Top 0.406: R76.2 36.94,12.01 IC21.7 36.67,12.06 v39.85,12.06 | R77.1 33.81,19.68 v33.81,21.27
  Bottom 0.406: v39.85,12.06 39.85,21.27 v33.81,21.27
N$68  (via drill 0.6)
  Top 0.406: R67.2 53.29,40.86 IC26.1 53.02,40.8 v56.52,40.8 | R68.1 50.16,33.18 v50.16,31.59
  Bottom 0.406: v50.16,31.59 56.52,31.59 v56.52,40.8
N$69
  Top 0.406: IC26.13 52.02,35.66 R68.2 R69.1
N$72
  Top 0.406: R93.1 R92.2 46.41,35.66 IC26.9
N$73  (via drill 0.6)
  Top 0.406: R91.2 45.14,40.86 IC26.7 45.4,40.8 v42.23,40.8 | R92.1 48.26,33.18 v48.26,31.59
  Bottom 0.406: v48.26,31.59 42.23,31.59 v42.23,40.8
N$76  (via drill 0.6)
  Top 0.406: R94.2 61.01,40.86 IC27.7 61.28,40.8 v58.1,40.8 | R95.1 64.14,33.18 v64.14,31.59
  Bottom 0.406: v64.14,31.59 58.1,31.59 v58.1,40.8
N$77
  Top 0.406: R96.1 R95.2 62.28,35.66 IC27.9
N$78
  Top 0.406: IC27.13 67.89,35.66 R71.2 R72.1
N$79  (via drill 0.6)
  Top 0.406: R70.2 69.16,40.86 IC27.1 68.9,40.8 v71.12,40.8 | R71.1 66.04,33.18 v66.04,31.59
  Bottom 0.406: v66.04,31.59 71.12,31.59 v71.12,40.8
ROW1
  Top 0.254: X2.5 92.87,19.92 92.87,17.46 88.94,17.46 U$2.19
ROW2
  Top 0.254: X2.6 92.39,20.42 92.39,18.1 88.94,18.1 U$2.20
ROW3
  Top 0.254: X2.7 91.92,20.92 91.92,18.73 88.94,18.73 U$2.21
ROW4
  Top 0.254: X2.8 91.44,21.42 91.44,19.37 88.94,19.37 U$2.22
ROW5
  Top 0.254: X2.9 90.96,21.92 90.96,20 88.94,20 U$2.23
ROW6
  Top 0.254: X2.10 90.49,22.42 90.49,20.64 88.94,20.64 U$2.24
ROW7
  Top 0.254: X2.11 90.01,22.92 90.01,21.27 88.94,21.27 U$2.25
ROW8
  Top 0.254: X2.12 89.53,23.42 89.53,21.99 88.94,21.99 U$2.26
ROW9
  Top 0.254: U$2.11 86.52,16.77 86.52,23.89 93.91,23.89 X2.13
ROW10
  Top 0.254: U$2.10 86.04,17.43 86.04,24.45 93.91,24.45 X2.14
ROW11
  Top 0.254: U$2.9 85.57,18.07 85.57,24.92 93.91,24.92 X2.15
ROW12
  Top 0.254: U$2.8 85.09,18.73 85.09,25.4 93.91,25.4 X2.16
ROW13
  Top 0.254: U$2.7 84.61,19.38 84.61,25.88 93.91,25.88 X2.17
ROW14
  Top 0.254: U$2.6 84.14,20.02 84.14,26.43 93.91,26.43 X2.18
ROW15
  Top 0.254: U$2.5 83.66,20.68 83.66,26.91 93.91,26.91 X2.19
ROW16
  Top 0.254: U$2.4 81.6,21.32 81.6,27.38 93.91,27.38 X2.20
ROWB0
  Top 0.254: U$2.17 90.81,16.12 90.81,11.75 78.74,11.75 78.74,18.41 JP14.5
ROWB1
  Top 0.254: U$2.16 90.17,15.47 90.17,12.22 81.12,12.22 81.12,19.68 77.47,19.68 JP14.6
ROWB2
  Top 0.254: U$2.15 88.9,14.82 88.9,12.7 81.6,12.7 81.6,20.64 80.01,20.64 JP14.7
ROWB3  (via drill 0.6)
  Top 0.254: JP14.8 75.72,20.95 75.72,10.79 v82.71,10.79 | v82.71,13.65 82.67,13.65 U$2.14
  Bottom 0.254: v82.71,10.79 v82.71,13.65
ROWEN  (via drill 0.6)
  Top 0.254: U$2.18 91.76,16.77 v91.76,15.56
  Bottom 0.254: v91.76,15.56 92.39,15.56 92.39,26.04 JP14.11
VDS_IN  (via drill 0.6)
  Top 0.254: IC3.3 v78.42,3.33
  Bottom 0.254: JP5.1 67.31,5.71 78.42,5.71 v78.42,3.33
VDS_OUT  (via drill 0.6)
  Top 0.254: U$2.28 87,23.27 87,15.72 v86.52,15.72 | v83.19,4.13 80.58,4.13 IC3.2 IC3.1 80.58,6.03 82.87,6.03 v83.19,5.71 | v86.52,9.68 88.27,9.68 v88.27,4.13
  Bottom 0.254: v86.52,15.72 v86.52,9.68 | v88.27,4.13 v83.19,4.13 | v83.19,5.71 83.19,6.19 39.37,6.19 JP7.3
VGS_IN  (via drill 0.6)
  Top 0.254: v83.19,2.22 85.78,2.22 IC3.5
  Bottom 0.254: JP5.2 69.85,5.08 76.83,5.08 76.83,2.22 v83.19,2.22
VGS_OUT
  Top 0.254: JP2.2 JP2.4 JP2.6 JP2.8 87.63,2.54 | IC3.7 IC3.6 85.78,3.17 87.63,3.17 87.63,2.54 | JP7.2 36.83,1.27 87.63,1.27 87.63,2.54
VMID  (via drill 0.6)
  Top 0.254: v31.59,7.62 IC21.3
  Top 0.406: IC26.5 47.94,39.21 | 47.94,39.21 50.48,39.21 | IC26.3 50.48,39.21 | 50.48,39.21 IC26.12 | IC27.5 63.82,39.21 | 66.36,39.21 IC27.12 | IC27.3 66.36,39.21 | 66.36,39.21 63.82,39.21 | IC25.10 31.59,39.21 | IC25.3 34.13,39.21 | 34.13,39.21 IC25.12 | IC25.5 31.59,39.21 | 31.59,39.21 34.13,39.21 | 16.03,39.21 IC24.5 | IC19.10 18.57,13.65 | 18.57,13.65 IC19.5 | 16.03,13.65 IC19.3 | 16.03,14.92 IC19.12 16.03,13.65 | 16.03,13.65 18.57,13.65 | IC21.12 31.59,13.65 | 31.59,13.65 IC21.3 | IC23.5 66.2,13.65 | IC23.3 63.66,13.65 | IC23.10 66.2,13.65 | 66.2,13.65 63.66,13.65 | IC22.10 50.64,13.65 | 50.64,13.65 IC22.5 | 48.1,13.65 IC22.12 | IC22.3 48.1,13.65 | 48.1,13.65 50.64,13.65 | 34.13,13.65 IC21.10 | IC21.5 34.13,13.65 | 34.13,13.65 31.59,13.65 | 18.57,39.21 IC24.12 | 18.57,39.21 16.03,39.21 | 34.13,13.65 48.1,13.65 | IC23.12 63.66,13.65 | 18.57,13.65 31.59,13.65 | 50.64,13.65 63.66,13.65 | IC24.3 18.57,39.21 | 18.57,39.21 31.59,39.21 | IC26.10 47.94,39.21 | 47.94,39.21 34.13,39.21 | IC27.10 63.82,39.21 | 63.82,39.21 50.48,39.21 | 2.38,19.61 2.38,5.08 10.32,5.08 10.32,13.65 | 10.32,13.65 16.03,13.65 | IC24.10 16.03,39.21 | 16.03,39.21 10.32,39.21 10.32,13.65
  Top 0.813: IC2.3 2.38,19.61 C7.1
  Bottom 0.254: JP7.4 41.91,1.27 31.59,1.27 v31.59,7.62
VOUT  (via drill 0.6)
  Top 0.254: U$3.28 46.2,24.25 46.2,23.81 49.85,23.81 v49.85,24.77 | v57.15,10.95 v57.15,8.33
  Bottom 0.254: v49.85,24.77 57.15,24.77 v57.15,10.95 | v57.15,8.33 34.29,8.33 JP7.1
(copper drawn outside any net)
  shapes: Top area x1

### Text on the board
tValues: Palacios Group, MIT | DAC0 | DAC1 | G1 | G2 | G3 | G4 | GND | GND | OUT | VGS | VDS | MID | 5V